# EAGLE design Logic Engine v0.1 (EAGLE 6.5.0)
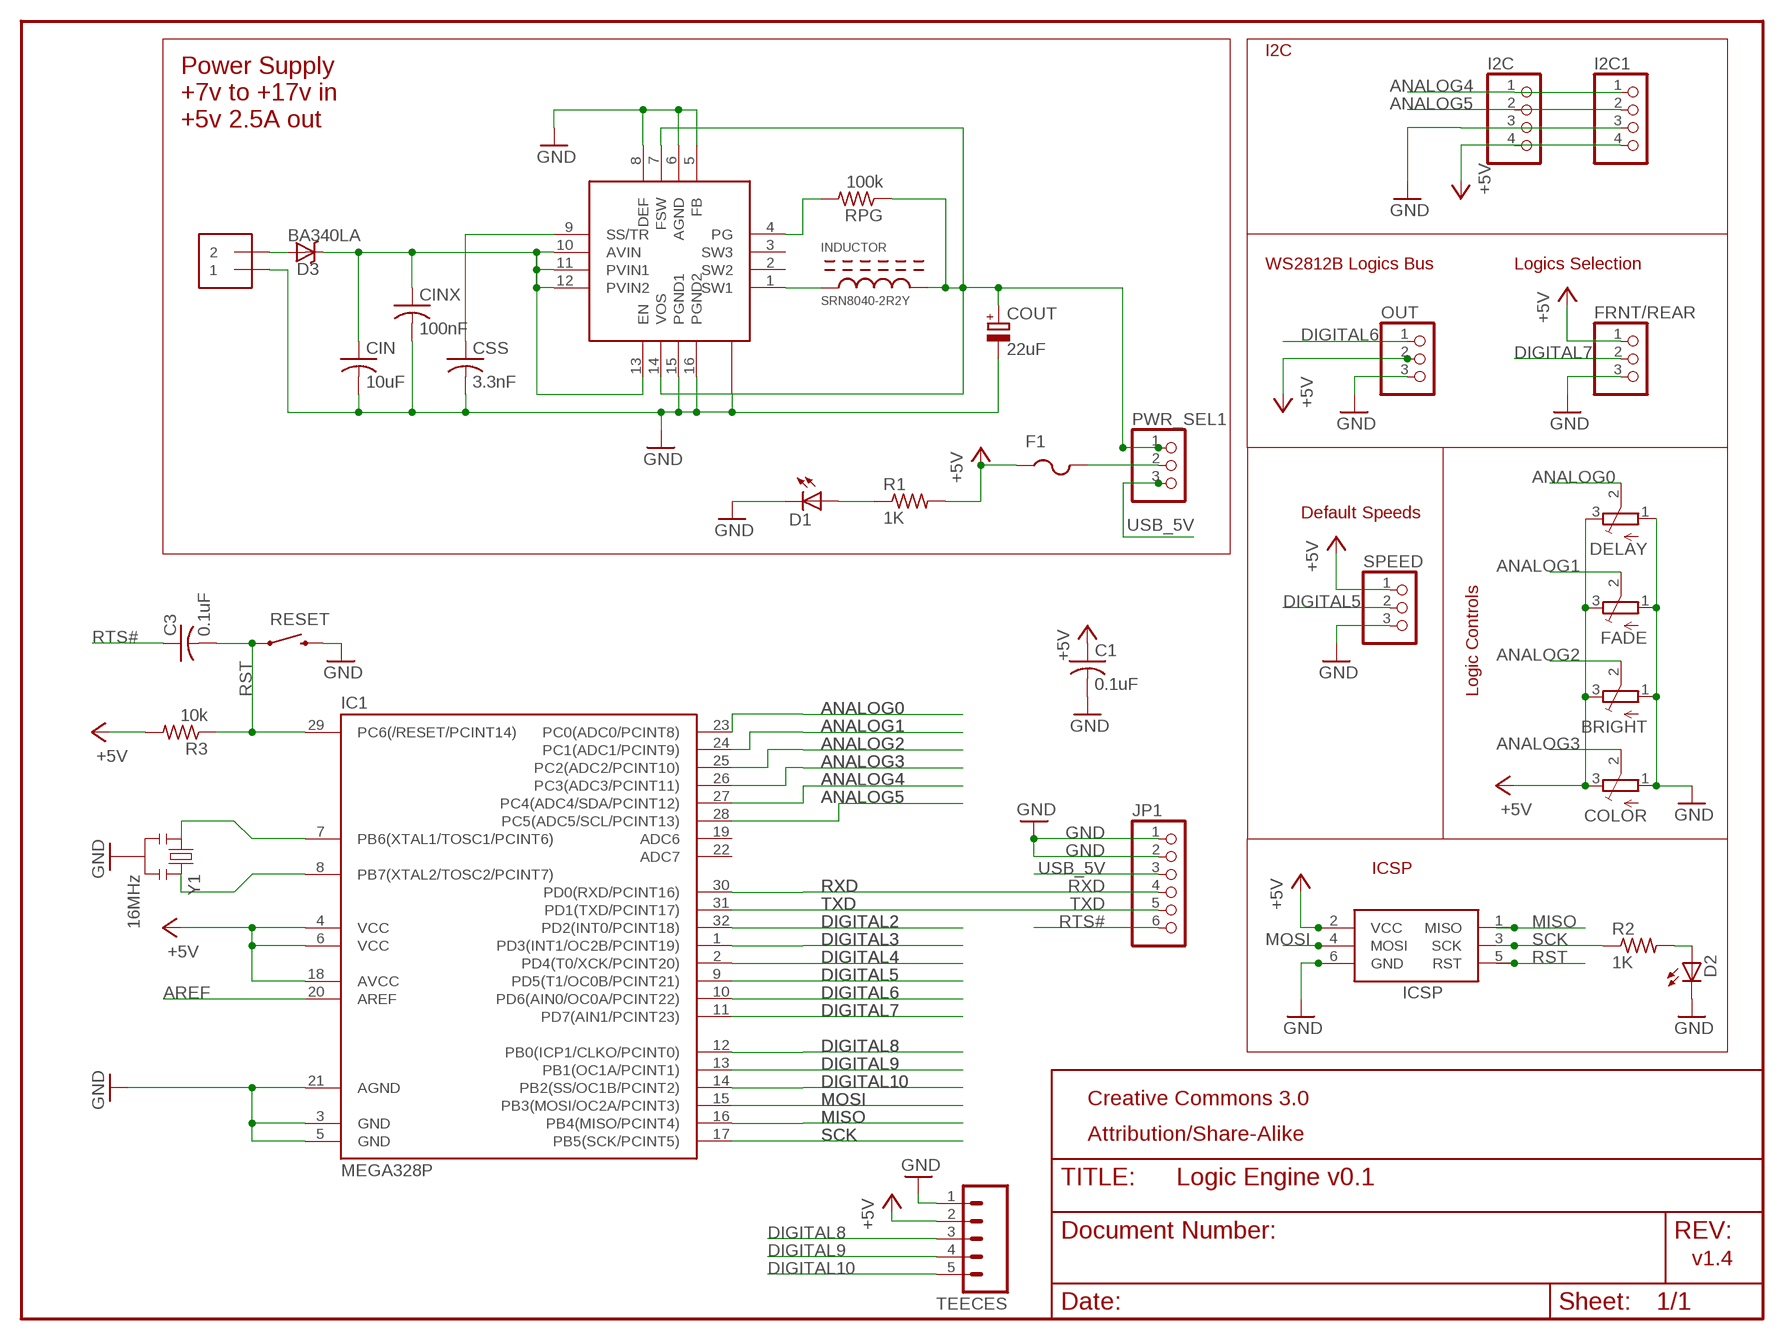
[diagram p0: schematic, sheet 1]

## Parts
BRIGHT  TRIMPOT3364W  [3364]
C1  0.1uF  C-USC0805K  [C0805K]
C3  0.1uF  C-USC0805K  [C0805K]
CIN  10uF  C-USC1206  [C1206]
CINX  100nF  C-USC0805K  [C0805K]
COLOR  TRIMPOT3364W  [3364]
COUT  22uF  CAPACITOR_POL-CASE_B  [CASE_B]
CSS  3.3nF  C-USC0805K  [C0805K]
D1  LEDCHIPLED_1206  [CHIPLED_1206]
D2  Green  LEDCHIPLED_1206  [CHIPLED_1206]
D3  BA340LA  B340A  [SMA-DIODE]
DELAY  TRIMPOT3364W  [3364]
EXT.PWR  1X2-3.5MM  [1X2-3.5MM]
F1  PTCFUSE-1812  [1812]
FADE  TRIMPOT3364W  [3364]
FRNT/REAR  PINHD-1X3  [1X03]
I2C  PINHD-1X4CB  [1X04-CB]
I2C1  PINHD-1X4CB  [1X04-CB]
IC1  MEGA328P  MEGA48/88/168-AU  [TQFP32-08]
ICSP  AVRISP-6  [AVRISP]
INDUCTOR  SRN8040-2R2Y  SRN8040  [SRN8040]
JP1  PINHD-1X6CLEAN  [1X06-CLEAN]
OUT  PINHD-1X3  [1X03]
PWR_SEL1  PINHD-1X3  [1X03]
R1  1K  R-US_R0805  [R0805]
R2  1K  R-US_R0805  [R0805]
R3  10k  R-US_R0805  [R0805]
REG  TPS62133  TPS6213X  [TPS6213X]
RESET  SWITCH-MOMENTARY-2SMD  [TACTILE_SWITCH_SMD]
RPG  100k  R-US_R0805  [R0805]
SPEED  PINHD-1X3  [1X03]
TEECES  M05PTH  [1X05]
Y1  16MHz  RESONATOR16MHZ  [RESONATOR-SMD]

## Nets
+5V [supply]: BRIGHT.3(E) C1.1 COLOR.3(E) DELAY.3(E) F1.1 FADE.3(E) FRNT/REAR.1 I2C1.4 I2C.4 IC1.4(VCC) IC1.6(VCC) IC1.18(AVCC) ICSP.2(VCC) OUT.2 R1.2 R3.2 SPEED.1 TEECES.2
ANALOG0: DELAY.2(S) IC1.23(PC0(ADC0/PCINT8))
ANALOG1: FADE.2(S) IC1.24(PC1(ADC1/PCINT9))
ANALOG2: BRIGHT.2(S) IC1.25(PC2(ADC2/PCINT10))
ANALOG3: COLOR.2(S) IC1.26(PC3(ADC3/PCINT11))
ANALOG4: I2C1.1 I2C.1 IC1.27(PC4(ADC4/SDA/PCINT12))
ANALOG5: I2C1.2 I2C.2 IC1.28(PC5(ADC5/SCL/PCINT13))
AREF: IC1.20(AREF)
DIGITAL2: IC1.32(PD2(INT0/PCINT18))
DIGITAL3: IC1.1(PD3(INT1/OC2B/PCINT19))
DIGITAL4: IC1.2(PD4(T0/XCK/PCINT20))
DIGITAL5: IC1.9(PD5(T1/OC0B/PCINT21)) SPEED.2
DIGITAL6: IC1.10(PD6(AIN0/OC0A/PCINT22)) OUT.1
DIGITAL7: FRNT/REAR.2 IC1.11(PD7(AIN1/PCINT23))
DIGITAL8: IC1.12(PB0(ICP1/CLKO/PCINT0)) TEECES.3
DIGITAL9: IC1.13(PB1(OC1A/PCINT1)) TEECES.4
DIGITAL10: IC1.14(PB2(SS/OC1B/PCINT2)) TEECES.5
GND [supply]: BRIGHT.1(A) C1.2 CIN.2 CINX.2 COLOR.1(A) COUT.- CSS.2 D1.C D2.C DELAY.1(A) EXT.PWR.1 FADE.1(A) FRNT/REAR.3 I2C1.3 I2C.3 IC1.3(GND) IC1.5(GND) IC1.21(AGND) ICSP.6(GND) JP1.1 JP1.2 OUT.3 REG.5(FB) REG.6(AGND) REG.8(DEF) REG.15(PGND1) REG.16(PGND2) REG.17-THERMALPAD(THERM) RESET.3 SPEED.3 TEECES.1 Y1.2
MISO: IC1.16(PB4(MISO/PCINT4)) ICSP.1(MISO)
MOSI: IC1.15(PB3(MOSI/OC2A/PCINT3)) ICSP.4(MOSI)
N$1: IC1.7(PB6(XTAL1/TOSC1/PCINT6)) Y1.1
N$2: IC1.8(PB7(XTAL2/TOSC2/PCINT7)) Y1.3
N$3: INDUCTOR.P$1(P1) REG.1(SW1)
N$4: D2.A R2.2
N$5 [supply]: D1.A R1.1
N$6 [supply]: CIN.1 CINX.1 D3.C REG.10(AVIN) REG.11(PVIN1) REG.12(PVIN2) REG.13(EN)
N$7: CSS.1 REG.9(SS/TR)
N$8: REG.4(PG) RPG.2
N$9 [supply]: COUT.+ INDUCTOR.P$2(P2) PWR_SEL1.1 REG.7(FSW) REG.14(VOS) RPG.1
N$10: F1.2 PWR_SEL1.2
N$11: D3.A EXT.PWR.2
RST: C3.2 IC1.29(PC6(/RESET/PCINT14)) ICSP.5(RST) R3.1 RESET.1
RTS#: C3.1 JP1.6
RXD: IC1.30(PD0(RXD/PCINT16)) JP1.4
SCK: IC1.17(PB5(SCK/PCINT5)) ICSP.3(SCK) R2.1
TXD: IC1.31(PD1(TXD/PCINT17)) JP1.5
USB_5V [supply]: JP1.3 PWR_SEL1.3
Unconnected: IC1.19(ADC6) IC1.22(ADC7) REG.2(SW2) REG.3(SW3)

## Notes on the sheet
- I2C
- Power Supply
  +7v to +17v in
  +5v 2.5A out
- WS2812B Logics Bus | Logics Selection
- Default Speeds
- Logic Controls
- ICSP
- Creative Commons 3.0
- Attribution/Share-Alike
- v1.4

## Library data of the parts
BRIGHT COLOR DELAY FADE = rseries:TRIMPOT: SMT trimmer potentiometer part number TC33X http://www.ladyada.net/library/eagle
C1 C3 CIN CINX CSS = adafruit:C-US: CAPACITOR, American symbol
COUT = dp_devices:CAPACITOR_POL: Polarized capacitor in various packages
D1 D2 = minimidi:LED: LED OSRAM: - CHIPLED LG R971, LG N971, LY N971, LG Q971, LY Q971, LO R971, LY R971 LH N974, LH R974 LS Q976, LO Q976, LY Q976 LO Q996 - Hyper CHIPLED LW Q18S LB Q993, LB Q99A, LB R99A - SideLED LS A670, LO A670, LY A670, LG A670, LP A670 LB A673, LV A673, LT A673, LW A673 LH A674 LY A675 LS A676, LA A676, LO A676, LY A676, LW A676 LS A679, LY A679, LG A679 - Hyper Micro SIDELED® LS Y876, LA Y876, LO Y876, LY Y876 LT Y87S - SmartLED LW L88C, LW L88S LB L89C, LB L89S, LG L890 LS L89K, LO L89K, LY L89K LS L896, LA L896, LO L896, LY L896 - TOPLED LS T670, LO T670, LY T670, LG T670, LP T670 LSG T670, LSP T670, LSY T670, LOP T670, LYG T670 LG T671, LOG T671, LSG T671 LB T673, LV T673, LT T673, LW T673 LH T674 LS T676, LA T676, LO T676, LY T676, LB T676, LH T676, LSB T676, LW T676 LB T67C, LV T67C, LT T67C, LS T67K, LO T67K, LY T67K, LW E67C LS E67B, LA E67B, LO E67B, LY E67B, LB E67C, LV E67C, LT E67C LW T67C LS T679, LY T679, LG T679 LS T770, LO T770, LY T770, LG T770, LP T770 LB T773, LV T773, LT T773, LW T773 LH T774 LS E675, LA E675, LY E675, LS T675 LS T776, LA T776, LO T776, LY T776, LB T776 LHGB T686 LT T68C, LB T68C - Hyper Mini TOPLED® LB M676 - Mini TOPLED Santana® LG M470 LS M47K, LO M47K, LY M47K Source: http://www.osram.convergy.de/
D3 = SparkFun-DiscreteSemi:B340A: Schottky Diode 3A-40V; PROD_ID: DIO-09886; VALUE: BA340A
EXT.PWR = adafruit:1X2: 3.5mm Terminal block http://www.ladyada.net/library/pcb/eaglelibrary.html
F1 = adafruit:PTCFUSE: PTC fuses, resettable thermistors
FRNT/REAR OUT PWR_SEL1 SPEED = pinhead:PINHD-1X3: PIN HEADER
I2C I2C1 = carduino:PINHD-1X4: PIN HEADER
IC1 = avr-7:MEGA48/88/168
ICSP = adafruit:AVRISP: AVR ISP HEADER Standard 6 pin header for AVR programming
INDUCTOR = joymonkey:SRN8040
JP1 = carduino:PINHD-1X6: PIN HEADER
R1-R3 RPG = adafruit:R-US_: RESISTOR, American symbol
REG = joymonkey:TPS6213X: TPS6213 3-17V 3A Step-Down Converter in 3x3 QFN Package The TPS6213X family is an easy to use synchronous step down DC-DC converter optimized for applications with high power density. A high switching frequency of typically 2.5MHz allows the use of small inductors and provides fast transient response as well as high output voltage accuracy by utilization of the DCS-Control topology. With its wide operating input voltage range of 3V to 17V, the devices are ideally suited for systems powered from either a Li-Ion or other batteries as well as from 12V intermediate power rails. It supports up to 3A continuous output current at output voltages between 0.9V and 6V (with 100% duty cycle mode). The device, available in adjustable and fixed output voltage versions, is packaged in a 16-pin QFN package measuring 3 × 3 mm (RGT).
RESET = SparkFun-Electromechanical:SWITCH-MOMENTARY-2: Various NO switches- pushbuttons, reed, etc
TEECES = SparkFun-Connectors:M05: Header 5 Standard 5-pin 0.1" header. Use with straight break away headers (SKU : PRT-00116), right angle break away headers (PRT-00553), swiss pins (PRT-00743), machine pins (PRT-00117), and female headers (PRT-00115). Molex polarized connector foot print use with SKU : PRT-08230 with associated crimp pins and housings.
Y1 = SparkFun-FreqCtrl:RESONATOR: Resonator Small SMD resonator. Used, eg, on the Arduino Pro/ Pro Mini boards. 8MHz- XTAL-08895 16MHz- XTAL-08900; PROD_ID: XTAL-08900

## Net classes
1 supply: width 0.508 mm, drill 0.152 mm, clearance 0.203 mm

## Board
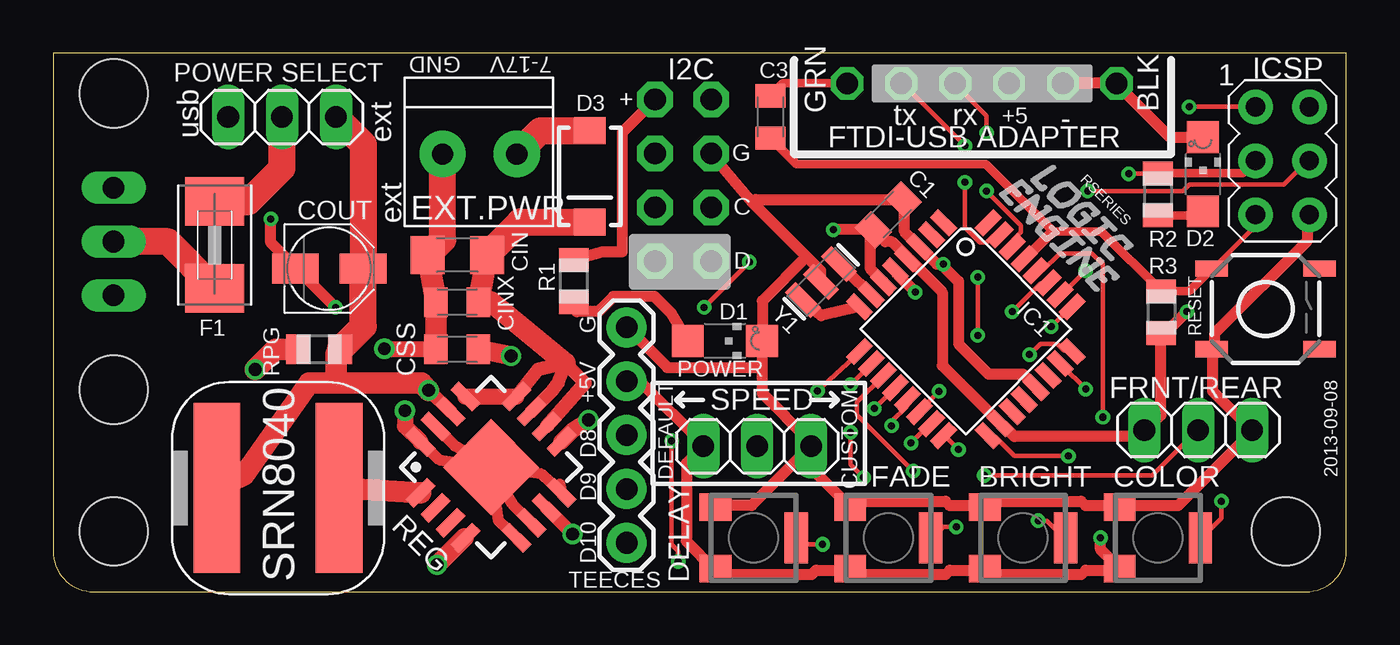
[diagram p1: board, top side]
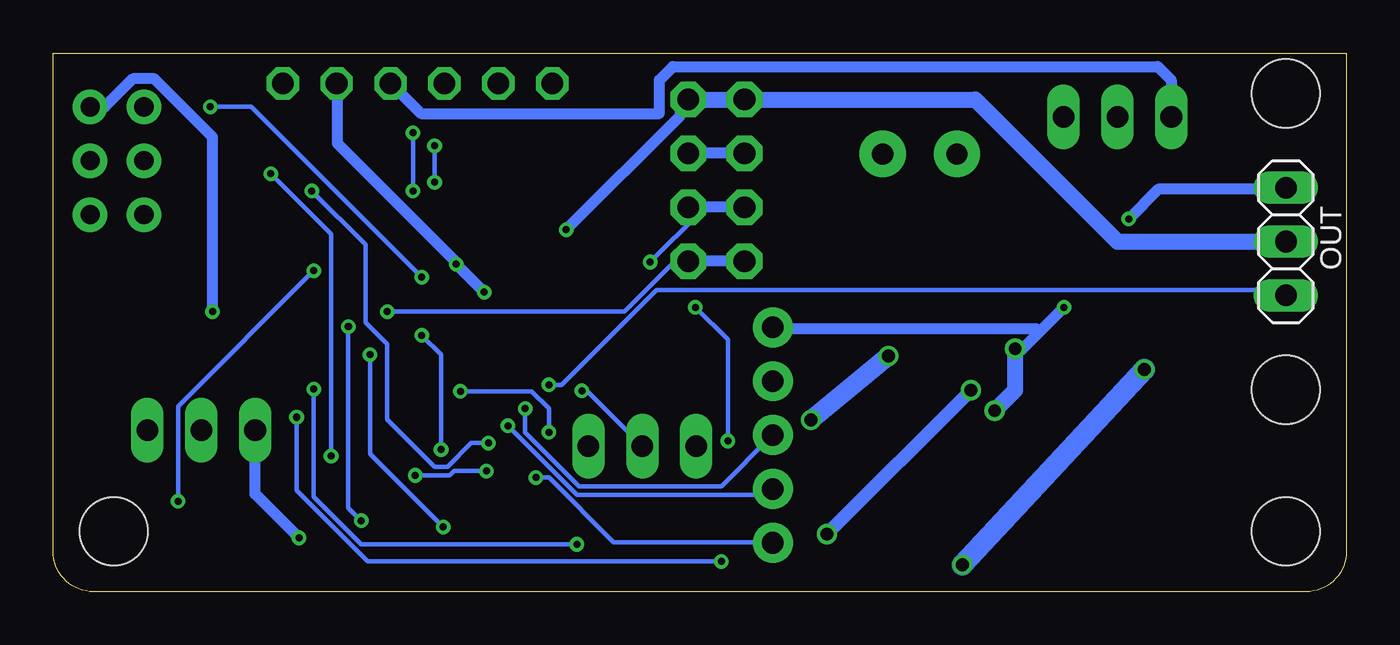
[diagram p2: board, bottom side, seen from below]

Size 60.96 x 25.4 mm. Coordinates in mm from the lower left corner, seen from the top.
Outline: 0,25.4 0,1.91 arc90 1.91,0 59.05,0 arc90 60.96,1.91 60.96,25.4 0,25.4
Copper layers (1*16): Top 0.0356mm / dielectric 1.5011mm / Bottom 0.0356mm
Design rules "LaenPCBOrder *": minimum track width 8mil, minimum drill 13mil, track to track 6mil, track to pad 6mil, pad to pad 6mil, via to via 12mil, smd to smd 6mil, copper to edge 15mil, drill to drill 6mil, minimum pad ring 7mil, minimum via ring 7mil, stop-mask expansion 4mil, vias tented up to drill 14mil, thermal gap 10mil
Holes 3.2 mm at 58.1,2.86 2.86,2.86 2.86,9.53 2.86,23.5

### Footprints (pad centres in the part's own frame; a part is rotated, then mirrored left to right if it is on the bottom)
3364 = smd 1.3 x 1.5: 1 -1.45,-1.8; 3 1.45,-1.8 | smd 2.4 x 1.1: 2 0,2
C0805K = smd 1.1 x 1.4: 1 -1,0; 2 1,0
C1206 = smd 1.6 x 1.8: 1 -1.4,0; 2 1.4,0
CASE_B = smd 2.2 x 1.4: + 1.6,0; - -1.6,0
CHIPLED_1206 = smd 1.5 x 1.5: A 0,-1.75; C 0,1.75
SMA-DIODE = smd 1.27 x 1.47: A -2.15,0; C 2.15,0
1X2-3.5MM = drill 1 pad 2.184: 1 1.8,0; 2 -1.7,0
1812 = smd 2.286 x 2.794: 1 -2.046,0; 2 2.046,0
1X03 = drill 1.016 long: 1 -2.54,0; 2 0,0; 3 2.54,0
1X04-CB = drill 1.016 pad 1.676 octagon: 1 -3.81,0; 2 -1.27,0; 3 1.27,0; 4 3.81,0
TQFP32-08 = smd 1.27 x 0.559: 1 -4.293,2.8; 2 -4.293,2; 3 -4.293,1.2; 4 -4.293,0.4; 5 -4.293,-0.4; 6 -4.293,-1.2; 7 -4.293,-2; 8 -4.293,-2.8; 17 4.293,-2.8; 18 4.293,-2; 19 4.293,-1.2; 20 4.293,-0.4; 21 4.293,0.4; 22 4.293,1.2; 23 4.293,2; 24 4.293,2.8 | smd 0.559 x 1.27: 9 -2.8,-4.293; 10 -2,-4.293; 11 -1.2,-4.293; 12 -0.4,-4.293; 13 0.4,-4.293; 14 1.2,-4.293; 15 2,-4.293; 16 2.8,-4.293; 25 2.8,4.293; 26 2,4.293; 27 1.2,4.293; 28 0.4,4.293; 29 -0.4,4.293; 30 -1.2,4.293; 31 -2,4.293; 32 -2.8,4.293
AVRISP = drill 0.9 pad 1.626: 1 -1.27,2.54; 2 1.27,2.54; 3 -1.27,0; 4 1.27,0; 5 -1.27,-2.54; 6 1.27,-2.54
SRN8040 = smd 2.2 x 8: P$1 1.125,4; P$2 6.875,4
1X06-CLEAN = drill 1.016 octagon: 1 -6.35,0; 2 -3.81,0; 3 -1.27,0; 4 1.27,0; 5 3.81,0; 6 6.35,0
R0805 = smd 1.1 x 1.4: 1 -1,0; 2 1,0
TPS6213X = smd 1.45 x 0.55: 1 -3.2,1.5; 2 -3.2,0.5; 3 -3.2,-0.5; 4 -3.2,-1.5; 9 3.2,-1.5; 10 3.2,-0.5; 11 3.2,0.5; 12 3.2,1.5 | smd 0.55 x 1.45: 5 -1.5,-3.2; 6 -0.5,-3.2; 7 0.5,-3.2; 8 1.5,-3.2; 13 1.5,3.2; 14 0.5,3.2; 15 -0.5,3.2; 16 -1.5,3.2 | smd 3.2 x 3.2: 17-THERMALPAD 0,0
TACTILE_SWITCH_SMD = smd 1.524 x 0.762: 1 -2.54,1.905; 2 2.54,1.905; 3 -2.54,-1.905; 4 2.54,-1.905
1X05 = drill 1.016 pad 1.88: 1 0,0; 2 2.54,0; 3 5.08,0; 4 7.62,0; 5 10.16,0
RESONATOR-SMD = smd 0.7 x 1.7: 1 -1.2,0; 2 0,0; 3 1.2,0

### Placement (x,y rotation side)
BRIGHT  45.72,2.54 270 top
C1  39.37,17.78 45 top
C3  33.81,22.38 270 top
CIN  19.05,15.88 180 top
CINX  19.05,13.65 180 top
COLOR  52.07,2.54 270 top
COUT  13.02,15.24 0 top
CSS  19.05,11.43 180 top
D1  31.67,11.82 270 top
D2  54.2,19.68 0 top
D3  25.3,19.58 270 top
DELAY  33.02,2.54 270 top
EXT.PWR  20.16,20.64 180 top
F1  7.62,16.35 90 top
FADE  39.37,2.54 270 top
FRNT/REAR  53.98,7.62 0 top
I2C  28.37,19.4 90 top
I2C1  31.03,19.4 90 top
IC1  43.02,12.38 315 top
ICSP  57.94,20.32 0 top
INDUCTOR  14.61,8.89 180 top
JP1  43.78,23.97 180 top
OUT  2.86,16.51 90 bottom
PWR_SEL1  10.79,22.38 180 top
R1  24.55,14.66 90 top
R2  52.07,18.73 270 top
R3  52.23,13.18 270 top
REG  20.64,5.87 45 top
RESET  57.15,13.34 0 top
RPG  12.54,11.43 180 top
SPEED  33.19,6.86 0 top
TEECES  27.03,12.47 270 top
Y1  36.2,14.61 225 top

### Tracks (layer width: path | path; a pad name or v marks a point on that pad's centre or on a via)
+5V  (via drill 0.33)
  Top 0.508: C1.1 39.23,16.51 39.53,16.51 40.27,15.77 IC1.4 40.34,15.7 41.91,14.13 41.91,10.66 IC1.18 44.81,7.82 45.31,7.32 51,7.32 51.21,7.52 FRNT/REAR.1 51.51,7.62 52.22,8.33 52.22,12.09 R3.2 52.43,12.19 v53.44,13.21 | IC1.6 39.12,14.63 38.51,15.24 38.51,16.97 C1.1 | R1.2 25.89,16.03 26.83,16.03 26.83,21.67 I2C.4 | v36.78,17.07 38.3,17.07 C1.1 | v49.37,2.54 49.37,1.99 COLOR.3 50.19,1.02 48.67,1.02 48.46,0.81 43.99,0.81 BRIGHT.3 43.89,1.02 42.27,1.02 42.06,0.81 37.59,0.81 FADE.3 37.49,1.02 35.97,1.02 35.76,0.81 31.5,0.81 31.39,0.91 DELAY.3 31.14,1.09 29.84,2.38 29.84,6.06 SPEED.1 30.58,7.01 27.74,9.86 27.13,9.86 TEECES.2
  Top 1.27: F1.1 5.42,16.51 OUT.2
  Bottom 0.508: ICSP.2 58.52,22.86 57.2,24.18 56.19,24.18 53.44,21.44 v53.44,13.21 | 31.24,22.96 I2C1.4 31.39,22.76 31.39,22.45 v36.78,17.07 | v49.37,2.54 51.44,4.6 FRNT/REAR.1
  Bottom 0.762: OUT.2 10.79,16.51 17.49,23.21 I2C.4 I2C1.4
ANALOG0  (via drill 0.33)
  Top 0.203: v48.67,9.55 47.55,10.67 IC1.23 | v36.27,2.23 35.36,2.23 35.05,2.54 DELAY.2
  Bottom 0.203: v48.67,9.55 48.67,4.47 46.43,2.23 v36.27,2.23
ANALOG1  (via drill 0.33)
  Top 0.203: v46.02,11.18 46.53,11.68 47.35,11.68 47.65,11.38 47.95,11.38 IC1.24 | v42.57,3.05 41.96,3.05 41.45,2.54 FADE.2
  Bottom 0.203: v46.02,11.18 46.02,6.5 v42.57,3.05
ANALOG2  (via drill 0.33)
  Top 0.203: v47.04,12.5 47.95,13.41 IC1.25 | v46.43,3.35 46.84,3.35 47.65,2.54 BRIGHT.2
  Bottom 0.203: v47.04,12.5 47.04,3.96 v46.43,3.35
ANALOG3  (via drill 0.33)
  Top 0.203: v48.67,15.14 47.55,14.02 IC1.26 | v55.07,4.27 55.07,3.45 54.15,2.54 COLOR.2
  Bottom 0.203: v48.67,15.14 55.07,8.74 v55.07,4.27
ANALOG4  (via drill 0.33)
  Top 0.203: v45.21,13.21 46.53,14.53 46.84,14.53 IC1.27
  Bottom 0.203: 31.7,15.54 31.24,15.54 I2C1.1 31.7,15.54 | v45.21,13.21 34.04,13.21 31.7,15.54
  Bottom 0.508: I2C.1 I2C1.1
ANALOG5  (via drill 0.33)
  Top 0.203: v49.48,8.23 49.48,15.44 48.97,15.95 47.45,15.95 46.63,15.14 46.43,15.14 IC1.28 | v29.46,1.42 29.46,1.93 29.16,2.23 v29.16,7.11 | v32.82,15.54 v30.68,13.41
  Bottom 0.203: v49.48,8.23 49.48,4.78 46.13,1.42 v29.46,1.42 | v29.16,7.11 29.16,11.89 v30.68,13.41 | v32.82,15.54 30.48,17.88 I2C1.2
  Bottom 0.508: I2C.2 I2C1.2
DIGITAL5  (via drill 0.33)
  Top 0.203: v36.04,9.47 38,11.28 IC1.9
  Bottom 0.203: v36.04,9.47 35.76,9.45 33.22,6.91 SPEED.2
DIGITAL6  (via drill 0.33)
  Top 0.203: v37.59,9.75 38.51,10.67 IC1.10
  Bottom 0.203: v37.59,9.75 36.98,9.75 32.51,14.22 3.15,14.22 2.95,14.02 OUT.1
DIGITAL7  (via drill 0.33)
  Top 0.203: v40.54,5.69 37.9,8.33 37.9,8.94 39.12,10.16 IC1.11 | v43.89,5.49 51.82,5.49 53.95,7.62 FRNT/REAR.2
  Bottom 0.203: v40.54,5.69 42.06,5.69 42.27,5.49 v43.89,5.49
DIGITAL8  (via drill 0.33)
  Top 0.203: v38.71,8.64 39.62,9.55 IC1.12
  Bottom 0.203: v38.71,8.64 38.71,7.52 36.17,4.98 29.46,4.98 27.13,7.32 TEECES.3
DIGITAL9  (via drill 0.33)
  Top 0.203: v39.52,7.82 39.52,8.03 40.23,8.74 40.23,9.04 IC1.13
  Bottom 0.203: v39.52,7.82 36.27,4.57 27.33,4.57 27.13,4.78 TEECES.4
DIGITAL10  (via drill 0.33)
  Top 0.203: v41.76,9.45 40.84,8.53 IC1.14 | v37.59,7.52 37.59,5.99 v38.2,5.38
  Bottom 0.203: v41.76,9.45 38.41,9.45 37.59,8.64 v37.59,7.52 | v38.2,5.38 37.59,5.38 34.54,2.34 27.13,2.34 TEECES.5
GND  (via drill 0.33, 0.6)
  Top 0.508: REG.16 18.21,6.22 REG.17-THERMALPAD | REG.15 18.94,6.87 REG.17-THERMALPAD | REG.5 20.99,3.35 REG.17-THERMALPAD | REG.6 21.66,4.12 REG.17-THERMALPAD | REG.17-THERMALPAD 23.02,5.55 REG.8 23.88,5.08 | D2.C 54.15,21.44 52.63,21.44 50.19,23.88 JP1.1 49.89,23.98 47.65,23.98 JP1.2 | 39.73,15.14 IC1.5 39.83,14.94 v40.64,14.12 | IC1.21 46.33,9.65 45.72,10.26 44.09,10.26 42.67,11.68 42.67,14.63 42.06,15.24 v41.96,15.44 41.66,15.44 40.84,16.26 IC1.3 40.74,16.36 40.13,16.97 40.13,18.39 C1.2 39.83,18.49 33.12,18.49 32.97,18.34 | v13.31,13.41 11.48,15.24 COUT.- 11.28,15.44 10.26,16.46 v10.26,17.58 | 59.23,17.78 ICSP.6 59.13,17.58 59.13,16.56 54.76,12.19 54.76,11.58 RESET.3 54.66,11.38 54.66,9.45 56.49,7.62 FRNT/REAR.3 56.39,7.42 53.03,4.06 50.49,4.06 COLOR.1 50.19,4.06 48.67,4.06 48.46,4.27 43.99,4.27 BRIGHT.1 43.89,4.06 42.27,4.06 42.06,4.27 37.59,4.27 FADE.1 37.49,4.06 35.36,6.2 SPEED.3 | 32.97,18.34 31.04,20.62 I2C1.3 | 32.97,18.34 35.51,15.8 | 35.51,15.8 36.17,15.14 36.17,14.63 Y1.2 | DELAY.1 31.29,4.06 32.92,4.06 35.56,6.71 SPEED.3 | 27.13,12.39 TEECES.1 27.33,12.19 28.96,10.57 33.43,10.57 | 35.51,15.8 33.43,13.72 33.43,11.89 D1.C 33.43,11.58 33.43,10.57 | 33.43,10.57 33.43,9.35 35.66,7.11 SPEED.3
  Top 0.762: CSS.2 15.65,11.43 v15.62,11.46 | v16.59,8.53 16.59,7.8 REG.16
  Top 1.016: CSS.2 CINX.2 CIN.2
  Top 1.27: CIN.2 18.36,16.59 EXT.PWR.1
  Bottom 0.508: I2C.3 I2C1.3 | v40.64,14.12 v41.96,15.44 42.06,15.65 47.55,21.13 47.55,23.88 JP1.2 | 14.48,12.24 15.34,11.38 v15.62,11.46 | 14.48,12.24 v13.31,13.41 | v10.26,17.58 8.84,19 2.95,19 OUT.3 | TEECES.1 27.03,12.39 14.63,12.39 14.48,12.24
  Bottom 0.762: v15.62,11.46 15.62,9.5 v16.59,8.53
MISO  (via drill 0.33)
  Top 0.203: v42.67,6.71 42.06,7.32 IC1.16 | v43.59,14.83 v43.59,12.09 | ICSP.1 v53.54,22.86
  Bottom 0.203: v42.67,6.71 42.67,11.18 v43.59,12.09 | v43.59,14.83 51.61,22.86 v53.54,22.86
MOSI  (via drill 0.33)
  Top 0.203: v40.44,7.01 41.35,7.92 IC1.15 | v48.77,18.9 53.24,18.9 53.54,19.2 58.01,19.2 59.13,20.32 ICSP.4
  Bottom 0.203: v40.44,7.01 41.25,7.01 42.37,5.89 42.98,5.89 45.21,8.13 45.21,11.68 46.23,12.7 46.23,16.36 v48.77,18.9
N$1
  Top 0.508: IC1.7 Y1.1
N$2
  Top 0.508: IC1.8 36.2,13.02 Y1.3
N$3
  Top 1.016: REG.1 INDUCTOR.P$1
N$4
  Top 0.406: D2.A 53.99,17.73 R2.2
N$5
  Top 0.508: R1.1 24.69,13.21 25.7,13.21 26.42,13.92 28.35,13.92 29.16,13.11 D1.A
N$6
  Top 0.635: REG.12 22.86,10.48 24.13,10.79 | REG.10 25.08,9.84 24.13,10.79 | REG.11 23.5,9.44 23.81,9.84 24.13,10.79
  Top 0.762: REG.13 REG.12
  Top 1.016: 24.13,10.79 20.64,13.65 CINX.1 CIN.1
  Top 1.27: CIN.1 22.01,17.43 D3.C
N$7  (via drill 0.6)
  Top 0.762: v25.24,8.1 24.5,7.62 REG.9
  Top 0.889: v21.59,11.11 CSS.1
  Bottom 0.889: v21.59,11.11 v25.24,8.1
N$8  (via drill 0.6)
  Top 0.203: REG.4 19.51,2.54 19.38,2.55
  Top 0.889: 19.38,2.55 v18.1,1.27
  Top 1.016: v9.53,10.48 10.48,11.43 RPG.2
  Bottom 1.016: v18.1,1.27 v9.53,10.48
N$9  (via drill 0.6)
  Top 0.635: REG.7 v24.49,2.72 | v17.7,9.5 17.72,9.5 REG.14
  Top 1.016: INDUCTOR.P$2 9,5.51 12.06,9.84 13.34,9.84 | 13.34,9.84 13.34,11.22 RPG.1 | 13.34,9.84 17.36,9.84 v17.7,9.5
  Top 1.27: PWR_SEL1.1 14.62,21.1 COUT.+ 14.62,12.51 RPG.1
  Bottom 0.635: v24.49,2.72 v17.7,9.5
N$10
  Top 1.27: F1.2 9.23,18.4 10.79,19.96 PWR_SEL1.2
N$11
  Top 1.27: EXT.PWR.2 22.96,21.73 D3.A
RST
  Top 0.203: ICSP.5 56.59,17.78 56.59,17.17 54.76,15.34 RESET.1
  Top 0.406: C3.2 35.04,20.16 43.97,20.16 47.15,16.99 | 47.15,16.99 47.06,16.99 IC1.29 45.86,15.7 47.15,16.99 | 47.15,16.99 49.42,16.99 R3.1 53.55,14.18 RESET.1
RTS#
  Top 0.406: C3.1 34.4,23.97 JP1.6
RXD  (via drill 0.33)
  Top 0.203: v43.99,18.9 45.62,17.27 45.62,16.97 45.21,16.56 45.21,16.36 IC1.30 | v43.99,21.64 43.99,22.45 42.57,23.88 JP1.4
  Bottom 0.203: v43.99,21.64 v43.99,18.9
SCK  (via drill 0.33)
  Top 0.203: v47.85,6.4 45.31,6.4 44.4,7.32 44.09,7.32 IC1.17 | v50.7,19.71 51.92,19.71 R2.1
  Top 0.406: ICSP.3 56.09,19.73 R2.1
  Bottom 0.203: v47.85,6.4 47.85,16.87 v50.7,19.71
TXD  (via drill 0.33)
  Top 0.203: v42.98,19.3 42.98,17.17 43.69,16.46 43.99,16.46 44.3,16.76 44.6,16.76 IC1.31 | v42.98,21.03 40.03,23.98 JP1.5
  Bottom 0.203: v42.98,21.03 v42.98,19.3
USB_5V
  Bottom 0.508: JP1.3 43.62,22.54 32.38,22.54 32.38,24.13 31.75,24.77 8.89,24.77 8.26,24.13 PWR_SEL1.3

### Text on the board
tPlace: POWER SELECT | GND | 7-17V | usb | GRN | tx | rx | +5 | - | BLK | ext | FTDI-USB ADAPTER | RSERIES | ext | G | POWER | CUSTOM | +5V | 2013-09-08 | D8 | DEFAULT | D9 | D10
_tsilk: + | G | C | D